# Altium project RelayDetect.PrjPcb
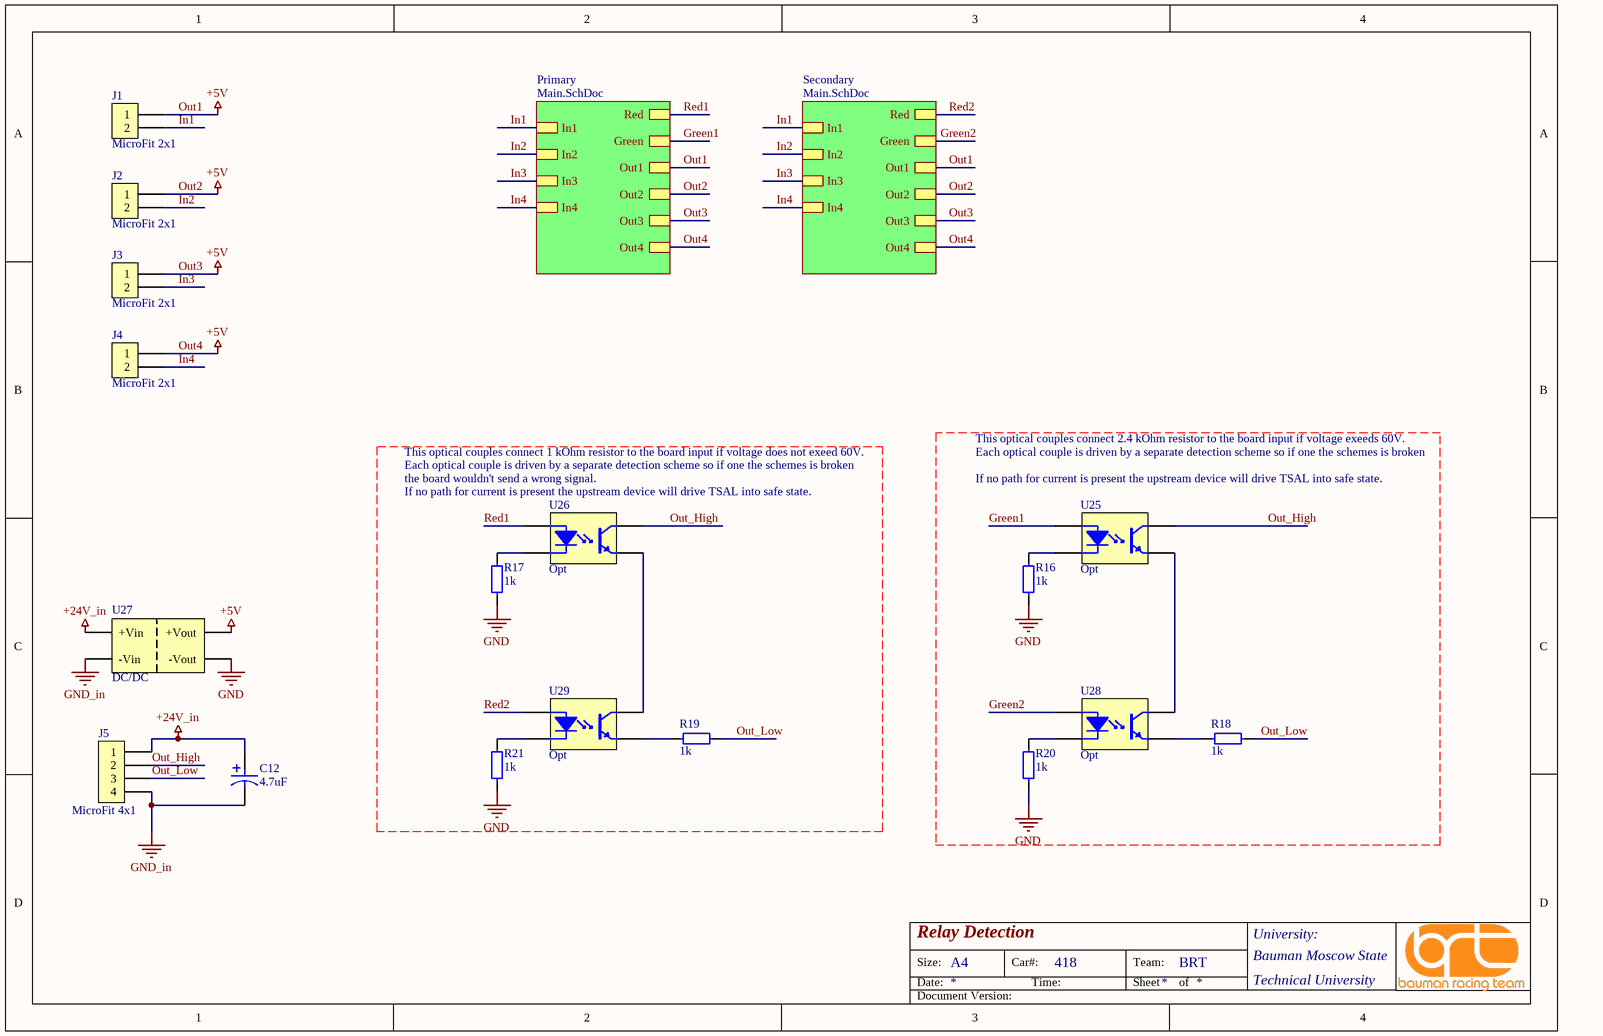
[diagram p0: 1.SchDoc]
3 sheets, 164 parts. Net scope: hierarchical (ports join the sheet entries above them; power ports are global).
Board file: RelayDetect.PcbDoc
Sheets:
  1.SchDoc
    Primary = Main.SchDoc
      Detection = DetectionPart.SchDoc
    Secondary = Main.SchDoc
      Detection = DetectionPart.SchDoc

## Sheet 1.SchDoc
size A4; Название устройства: Relay Detection

### Parts
(Parts that share a designator on the sheet are numbered #1, #2 ... from top to bottom, then left to right.)
*1  BRT Log  [BRT_Log]  (value not drawn)
C12#1  4.7uF  [Bar Cap 4x5.4]
J1  MicroFit 2x1  [MolexMicroFit 2x1]
J2  MicroFit 2x1  [MolexMicroFit 2x1]
J3  MicroFit 2x1  [MolexMicroFit 2x1]
J4  MicroFit 2x1  [MolexMicroFit 2x1]
J5  MicroFit 4x1  [MolexMicroFit 4x1]
R16#1  1k  [0603 Resistor]
R17#1  1k  [0603 Resistor]
R18#1  1k  [0603 Resistor]
R19#1  1k  [0603 Resistor]
R20#1  1k  [0603 Resistor]
R21#1  1k  [0603 Resistor]
U25#1  Opt  [FAIR-MDIP-4_V]
U26#1  Opt  [FAIR-MDIP-4_V]
U27#1  DC/DC  [SIP7]
U28#1  Opt  [FAIR-MDIP-4_V]
U29#1  Opt  [FAIR-MDIP-4_V]

### Sub-sheets
Primary = Main.SchDoc: Red, In1, Out3, In2, In3, Out1, Green, Out4, In4, Out2
Secondary = Main.SchDoc: Red, In1, Out3, In2, In3, Out1, Green, Out4, In4, Out2

### Nets
+24V_in: C12#1.2 J5.1 U27#1.1(+Vin)
GND: R16#1.1 R17#1.1 R20#1.1 R21#1.1 U27#1.4(-Vout)
GND_in: C12#1.1 J5.4 U27#1.2(-Vin)
Out1: J1.1 J2.1 J3.1 J4.1 U27#1.6(+Vout) ; sheet Primary/Out3, sheet Primary/Out1, sheet Primary/Out4, sheet Primary/Out2, sheet Secondary/Out3, sheet Secondary/Out1, sheet Secondary/Out4, sheet Secondary/Out2  [also labelled +5V, Out2, Out3, Out4]
Green1: U25#1.1(ANODE) ; sheet Primary/Green
Green2: U28#1.1(ANODE) ; sheet Secondary/Green
In1: J1.2 ; sheet Primary/In1, sheet Secondary/In1
In2: J2.2 ; sheet Primary/In2, sheet Secondary/In2
In3: J3.2 ; sheet Primary/In3, sheet Secondary/In3
In4: J4.2 ; sheet Primary/In4, sheet Secondary/In4
Out_High: J5.2 U25#1.4(COLLECTOR) U26#1.4(COLLECTOR)
Out_Low: J5.3 R18#1.1 R19#1.1
Red1: U26#1.1(ANODE) ; sheet Primary/Red
Red2: U29#1.1(ANODE) ; sheet Secondary/Red
NetR16#1_2: R16#1.2 U25#1.2(CATHODE)
NetR17#1_2: R17#1.2 U26#1.2(CATHODE)
NetR18#1_2: R18#1.2 U28#1.3(EMITTER)
NetR19#1_2: R19#1.2 U29#1.3(EMITTER)
NetR20#1_2: R20#1.2 U28#1.2(CATHODE)
NetR21#1_2: R21#1.2 U29#1.2(CATHODE)
NetU25#1_3: U25#1.3(EMITTER) U28#1.4(COLLECTOR)
NetU26#1_3: U26#1.3(EMITTER) U29#1.4(COLLECTOR)

### Notes on the sheet
- This optical couples connect 2.4 kOhm resistor to the board input if voltage exeeds 60V.
- This optical couples connect 1 kOhm resistor to the board input if voltage does not exeed 60V.
- (near U26#1) Each optical couple is driven by a separate detection scheme so if one the schemes is broken
- (near U26#1) the board wouldn't send a wrong signal.
- (near U26#1) If no path for current is present the upstream device will drive TSAL into safe state.
- Each optical couple is driven by a separate detection scheme so if one the schemes is broken
- (near U25#1) If no path for current is present the upstream device will drive TSAL into safe state.
- Size:
- Date:
- A4
- Car#:
- Time:
- 418
- Team:
- Sheet
- BRT
- of
- University:
- Technical University
- Bauman Moscow State
- Document Version:

### Library data of the parts
*1 = BRT Log: Team Logo
C12#1 = Cap Pol 4.7uF: ECAP SMD,  35V, 105°C; Part Number: B41121A7475M000; Manufacturer: Epcos; Type: Capacitor; ComponentLink1Description: Chip&Dip; ComponentLink1URL: https://www.chipdip.ru/product/b41121a7475m000
J1-J4 = Conn 2 [MicroFit]: Micro-Fit 3.0 Right-Angle Header, 3.00mm Pitch, Single Row, 2 Circuits, with Snap-in Plastic Peg PCB Lock, Tin, Glow-Wire Capable, Black; Part Number: 436500200; Manufacturer: Molex; ComponentLink1Description: Molex; ComponentLink1URL: https://www.molex.com/molex/products/part-detail/pcb_headers/0436500200; Type: Connector
J5 = Conn 4 [MicroFit]: Micro-Fit 3.0 Right-Angle Header, 3.00mm Pitch, Single Row, 4 Circuits, with Snap-in Plastic Peg PCB Lock, Tin, Glow-Wire Capable, Black; Part Number: 436500400; Manufacturer: Molex; ComponentLink1Description: Molex; ComponentLink1URL: https://www.molex.com/molex/products/part-detail/pcb_headers/0436500400; Type: Connector
R16#1 R17#1 R18#1 R19#1 R20#1 R21#1 = Res 1k (0603): 0.1W 0603 1k, 1%; Part Number: RC0603FR-071KL; Manufacturer: Taiwan; Type: Resistor; ComponentLink1Description: Chip&Dip; ComponentLink1URL: https://www.chipdip.ru/product0/9000079676
U25#1 U26#1 U28#1 U29#1 = Optocoupler [FOD817B]: Phototransistor Optocoupler, 4 us Rise, 3 us Fall, 5000 Vrms, -55 to 110 degC, 4-Pin MDIP, RoHS, Tape and Reel; Manufacturer: ON Semiconductor; Part Nomber: FOD817B; ComponentLink1Description: Chip&Dip; ComponentLink1URL: https://www.chipdip.ru/product/fod817b; ComponentLink2Description: DataSheet; ComponentLink2URL: https://static.chipdip.ru/lib/297/DOC000297284.pdf
U27#1 = DC/DC Isolated 12V [TMH]: The TMH series are ultra miniature, isolated 2 Watt DC/DC-converters in a Single-in-Line  package  (SIP); Manufacturer: Traco Power; Part Number: TMH2412S; Input Voltage: 24; Output Voltage: 12; ComponentLink1Description: Chip&Dip; ComponentLink1URL: https://www.chipdip.ru/product/tmv2412s; ComponentLink2Description: DataSheet; ComponentLink2URL: https://static.chipdip.ru/lib/005/DOC001005854.pdf; Type: IC

## Sheet Main.SchDoc
size A3; Date: 04.01.2021; Organization: Altium Limited; Address1: L3, 12a Rodborough Rd; Address2: Frenchs Forest; Address3: NSW; Address4: Australia 2086; SheetNumber: 1; SheetTotal: 3; Version: 1; Название устройства: Main
Used 2 times, as channels Primary, Secondary. Parts and nets are listed once, with the designators drawn on the sheet.
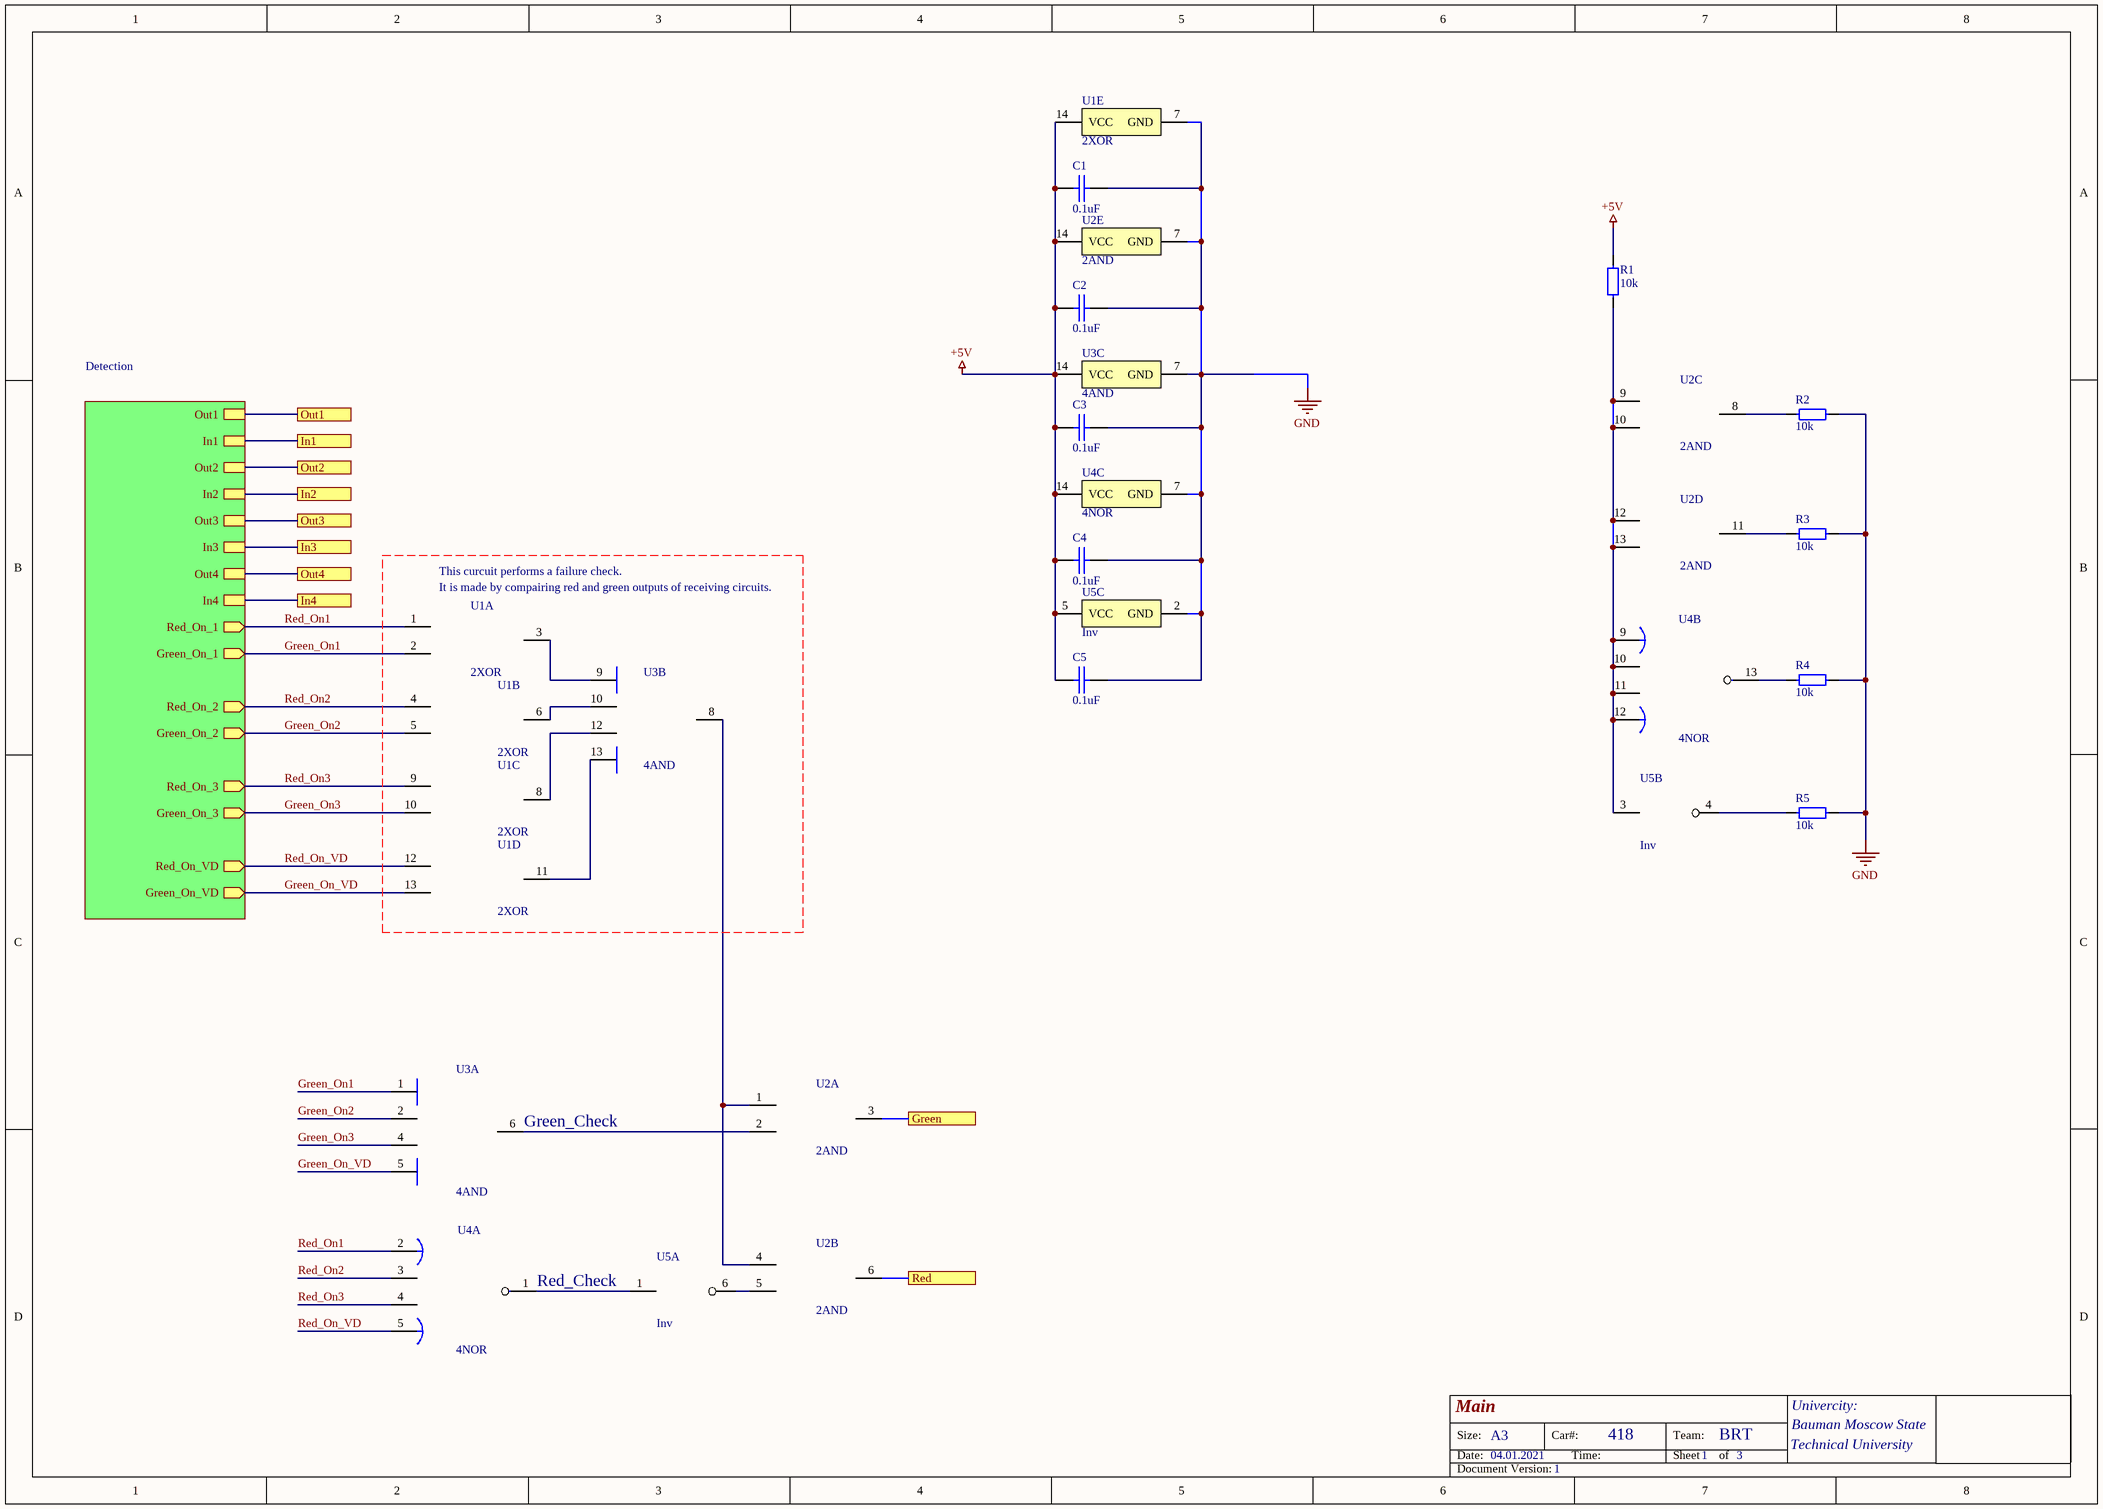
[diagram p1: Main.SchDoc]

### Parts
C1  0.1uF  [0603 Capicator]
C2  0.1uF  [0603 Capicator]
C3  0.1uF  [0603 Capicator]
C4  0.1uF  [0603 Capicator]
C5  0.1uF  [0603 Capicator]
R1  10k  [0603 Resistor]
R2  10k  [0603 Resistor]
R3  10k  [0603 Resistor]
R4  10k  [0603 Resistor]
R5  10k  [0603 Resistor]
U1  2XOR  [SOIC-14]  (parts A,B,C,D,E of 5)
U2  2AND  [SOIC-14]  (parts A,B,C,D,E of 5)
U3  4AND  [SOIC-14]  (parts A,B,C of 3)
U4  4NOR  [SOIC-14]  (parts A,B,C of 3)
U5  Inv  [SOT236]  (parts A,B,C of 3)

### Sub-sheets
Detection = DetectionPart.SchDoc: Green_On_2 (out), Red_On_1 (out), Red_On_VD (out), Green_On_VD (out), Red_On_2 (out), Green_On_3 (out), Red_On_3 (out), Green_On_1 (out), Out4, Out3, Out1, In3, In2, Out2, In1, In4

### Ports
Green, In1, In2, In3, In4, Out1, Out2, Out3, Out4, Red

### Nets
+5V: C1.2 C2.2 C3.2 C4.2 C5.2 R1.2 U1.14(VCC) U2.14(VCC) U3.14(VCC) U4.14(VCC) U5.5(VCC)
GND: C1.1 C2.1 C3.1 C4.1 C5.1 R2.1 R3.1 R4.1 R5.1 U1.7(GND) U2.7(GND) U3.7(GND) U4.7(GND) U5.2(GND)
Green: U2.3(1Y) ; port Green
Green_On1: U1.2(B) U3.1(A) ; sheet Detection/Green_On_1
Green_On2: U1.5(B) U3.2(B) ; sheet Detection/Green_On_2
Green_On3: U1.10(B) U3.4(C) ; sheet Detection/Green_On_3
Green_On_VD: U1.13(B) U3.5(D) ; sheet Detection/Green_On_VD
In1: port In1, sheet Detection/In1
In2: port In2, sheet Detection/In2
In3: port In3, sheet Detection/In3
In4: port In4, sheet Detection/In4
Out1: port Out1, sheet Detection/Out1
Out2: port Out2, sheet Detection/Out2
Out3: port Out3, sheet Detection/Out3
Out4: port Out4, sheet Detection/Out4
Red: U2.6(2Y) ; port Red
Red_On1: U1.1(A) U4.2(A) ; sheet Detection/Red_On_1
Red_On2: U1.4(A) U4.3(B) ; sheet Detection/Red_On_2
Red_On3: U1.9(A) U4.4(C) ; sheet Detection/Red_On_3
Red_On_VD: U1.12(A) U4.5(D) ; sheet Detection/Red_On_VD
NetR1_1: R1.1 U2.9(3A) U2.10(3B) U2.12(4A) U2.13(4B) U4.9(A) U4.10(B) U4.11(C) U4.12(D) U5.3(2А)
NetR2_2: R2.2 U2.8(3Y)
NetR3_2: R3.2 U2.11(4Y)
NetR4_2: R4.2 U4.13(Y)
NetR5_2: R5.2 U5.4(2Y)
NetU1_3: U1.3(Y) U3.9(A)
NetU1_6: U1.6(Y) U3.10(B)
NetU1_8: U1.8(Y) U3.12(C)
NetU1_11: U1.11(Y) U3.13(D)
NetU2_1: U2.1(1A) U2.4(2A) U3.8(Y)
NetU2_2: U2.2(1B) U3.6(Y)
NetU2_5: U2.5(2B) U5.6(1Y)
NetU4_1: U4.1(Y) U5.1(1A)

### Channels
Primary: designators C1=C38 C2=C39 C3=C40 C4=C41 C5=C42 R1=R27 R2=R28 R3=R29 R4=R30 R5=R31 U1=U42 U2=U43 U3=U44 U4=U45 U5=U46; ports Green=Green1 In1=In1 In2=In2 In3=In3 In4=In4 Out1=Out1 Out2=Out1 Out3=Out1 Out4=Out1 Red=Red1
Secondary: designators C1=C43 C2=C44 C3=C45 C4=C46 C5=C47 R1=R32 R2=R33 R3=R34 R4=R35 R5=R36 U1=U47 U2=U48 U3=U49 U4=U50 U5=U51; ports Green=Green2 In1=In1 In2=In2 In3=In3 In4=In4 Out1=Out1 Out2=Out1 Out3=Out1 Out4=Out1 Red=Red2

### Notes on the sheet
- (near U1) This curcuit performs a failure check.
- (near U1) It is made by compairing red and green outputs of receiving circuits.
- (near U3) Green_Check
- Red_Check
- Size:
- Date:
- A3
- Car#:
- Time:
- 418
- Team:
- Sheet
- BRT
- of
- Technical University
- Univercity:
- Bauman Moscow State
- Document Version:

### Library data of the parts
C1-C5 = Cap 0.1uF (0603): 0.1uF X7R 16V 10% 0603; Manufacturer: Murata Manufacturing; Part Number: GRM188R71C104KA01D; Type: Capacitor; ComponentLink1Description: Chip&Dip; ComponentLink1URL: https://www.chipdip.ru/product/grm188r71c104ka01d
R1-R5 = Res 10k (0603): 0.1W 0603 10k, 1%; Part Number: RC0603FR-0710KL; Manufacturer: Taiwan; Type: Resistor; ComponentLink1Description: Chip&Dip; ComponentLink1URL: https://www.chipdip.ru/product0/9000079736
U1 = 4(2XOR): 4 logic elements "2XOR"; Part Number: 74HC86D,653; Manufacturer: Nexperia; ComponentLink1Description: Chip&Dip; ComponentLink1URL: https://www.chipdip.ru/product/74hc86d; Type: IC; ComponentLink2Description: DataSheet; ComponentLink2URL: https://ru.mouser.com/datasheet/2/916/74HC_HCT86-1319799.pdf
U2 = 2And: 4 logic elements "2AND"; Part Number: SN74AC08DR; Manufacturer: Texas Instruments; ComponentLink1Description: DataSheet; ComponentLink1URL: https://static.chipdip.ru/lib/551/DOC001551527.pdf; ComponentLink2Description: Chip&Dip; ComponentLink2URL: https://www.chipdip.ru/product/sn74ac08dr; Type: IC
U3 = 2(4AND): 2 logic elements "4AND"; Part Number: 74HC21D,653; Manufacturer: Nexperia; ComponentLink1Description: Chip&Dip; ComponentLink1URL: https://www.chipdip.ru/product/74hc21d.653; Type: IC; ComponentLink2Description: DataSheet; ComponentLink2URL: https://static.chipdip.ru/lib/522/DOC011522559.pdf
U4 = 2(4NOR): 2 logic elements "4NOR"; Part Number: 74HC4002D,652; Manufacturer: Nexperia; ComponentLink1Description: Chip&Dip; ComponentLink1URL: https://www.chipdip.ru/product/74hc4002d; Type: IC; ComponentLink2Description: DataSheet; ComponentLink2URL: https://static.chipdip.ru/lib/493/DOC011493188.pdf
U5 = Inverter (SN74): Dual inverter, 1.65-5.5V; Manufacturer: Texas Instruments; Part Number: SN74LVC2G04DBVR; ComponentLink1Description: Chip&Dip; ComponentLink1URL: https://www.chipdip.ru/product/sn74lvc2g04dbvr-2; ComponentLink2Description: DataSheet; ComponentLink2URL: https://static.chipdip.ru/lib/021/DOC001021810.pdf; Type: IC

## Sheet DetectionPart.SchDoc
size A3; ENG_APP_DATE: --/--/--; DSN_APP_DATE: --/--/--; CHK_APP_DATE: --/--/--; Date: 04.01.2021; Organization: Altium Limited; Address1: L3, 12a Rodborough Rd; Address2: Frenchs Forest; Address3: NSW; Address4: Australia 2086; SheetNumber: 2; SheetTotal: 3; Название устройства: Detection Part; Version: 1
Used 2 times, as channels Primary/Detection, Secondary/Detection. Parts and nets are listed once, with the designators drawn on the sheet.
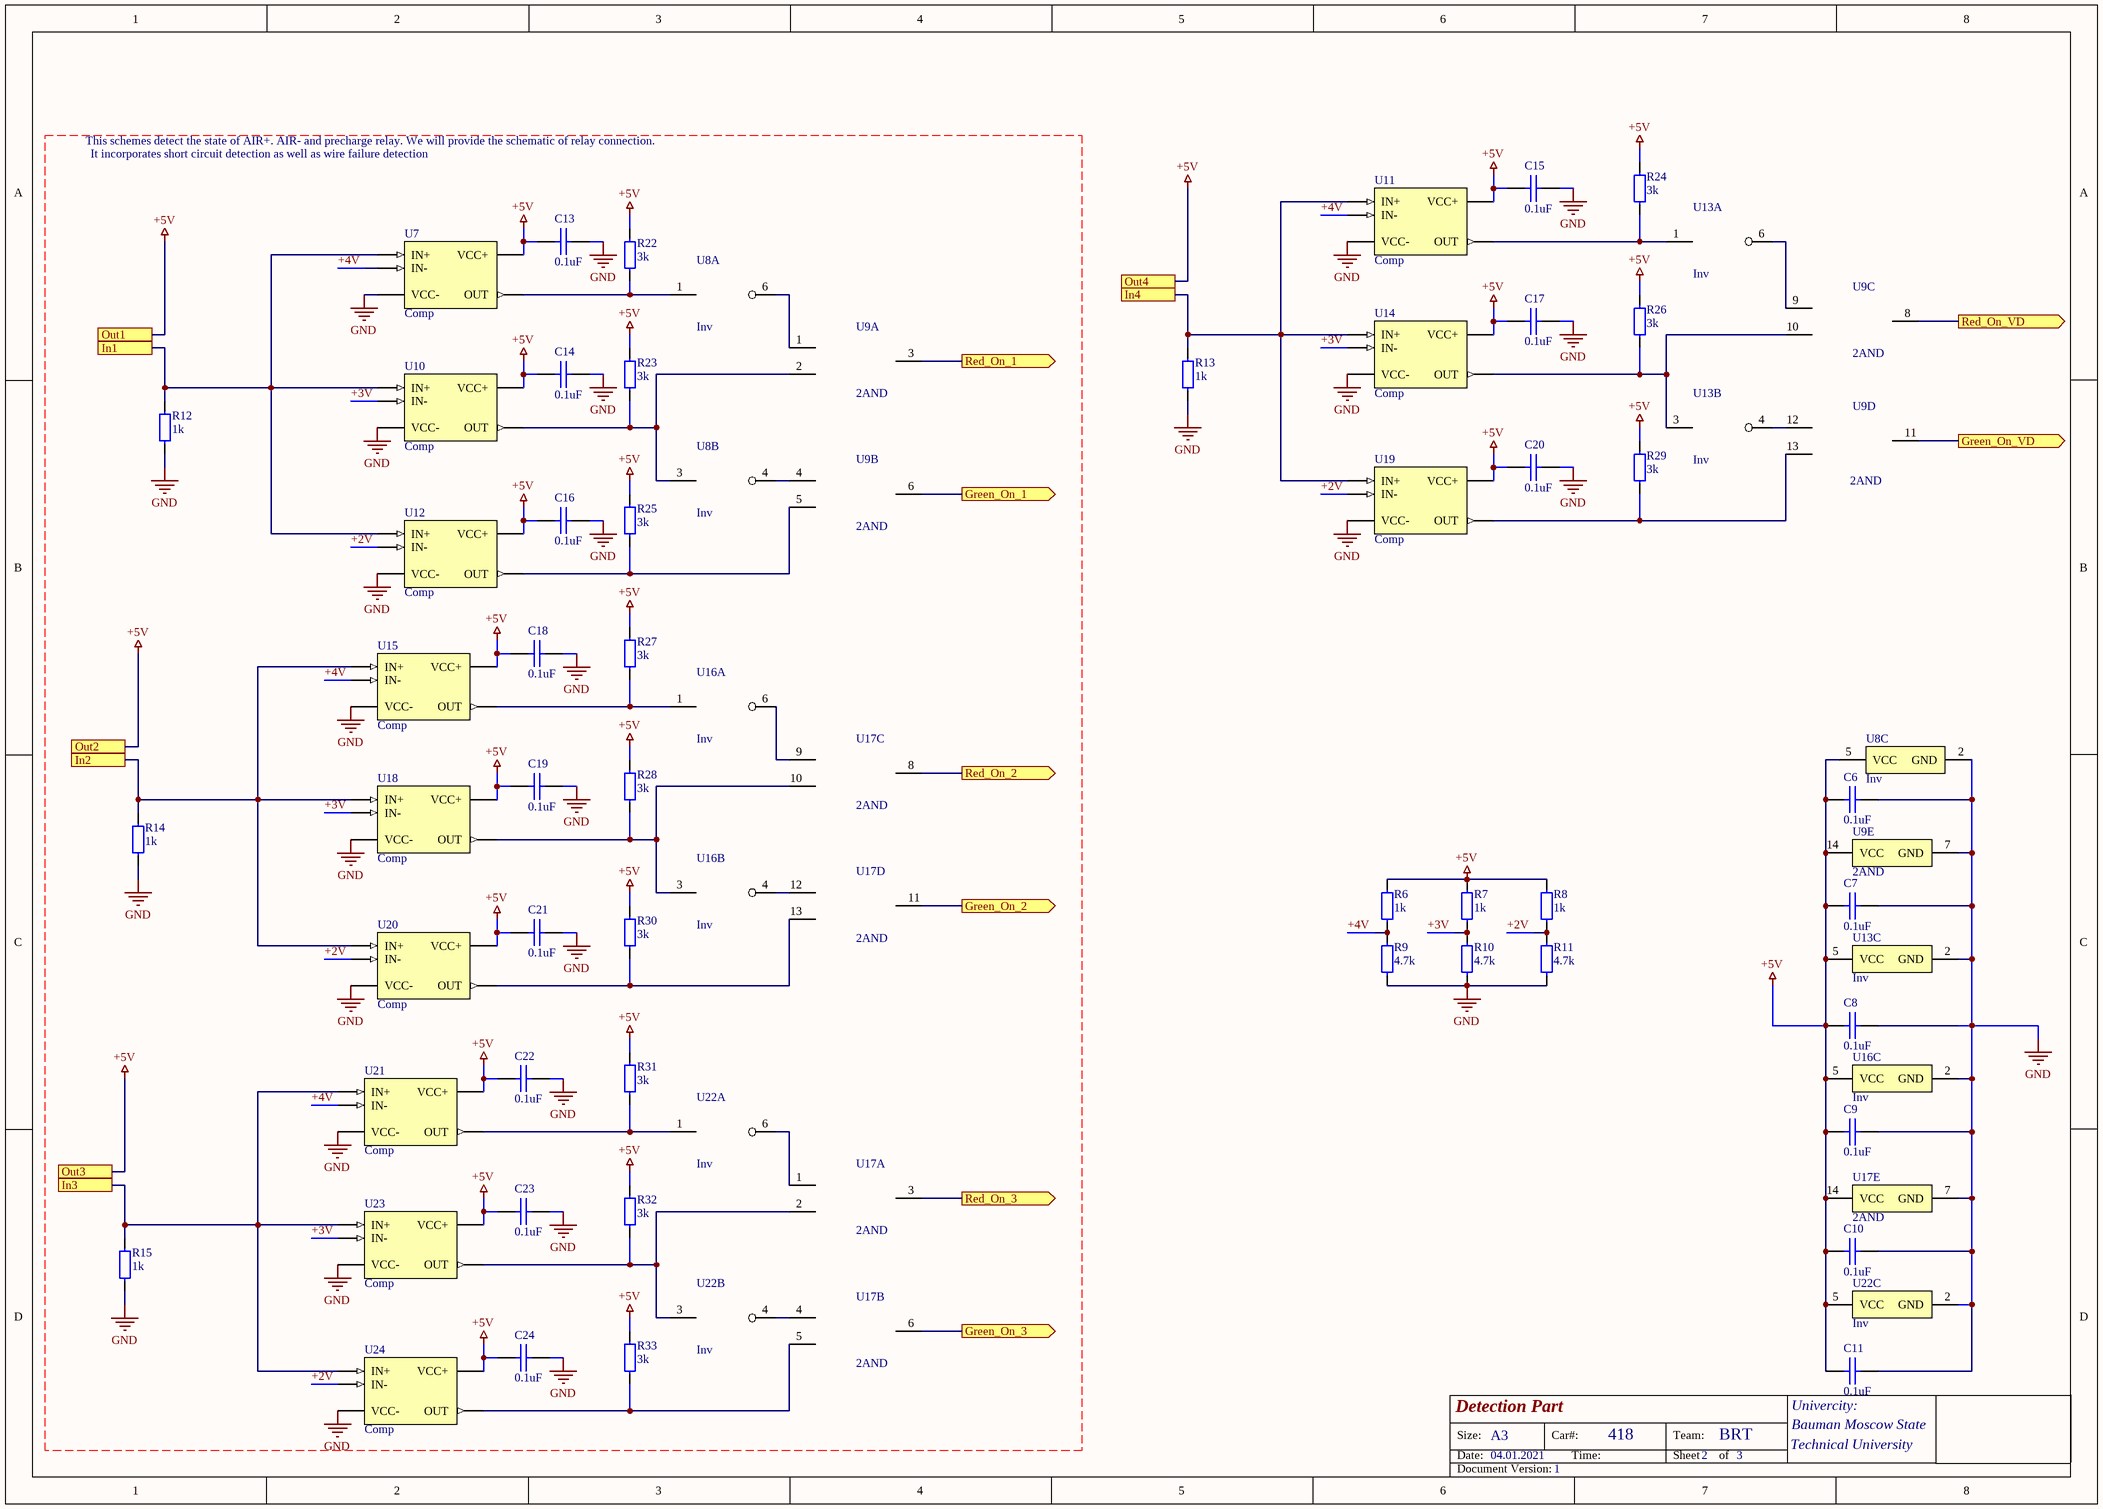
[diagram p2: DetectionPart.SchDoc]

### Parts
C6  0.1uF  [0603 Capicator]
C7  0.1uF  [0603 Capicator]
C8  0.1uF  [0603 Capicator]
C9  0.1uF  [0603 Capicator]
C10  0.1uF  [0603 Capicator]
C11  0.1uF  [0603 Capicator]
C13  0.1uF  [0603 Capicator]
C14  0.1uF  [0603 Capicator]
C15  0.1uF  [0603 Capicator]
C16  0.1uF  [0603 Capicator]
C17  0.1uF  [0603 Capicator]
C18  0.1uF  [0603 Capicator]
C19  0.1uF  [0603 Capicator]
C20  0.1uF  [0603 Capicator]
C21  0.1uF  [0603 Capicator]
C22  0.1uF  [0603 Capicator]
C23  0.1uF  [0603 Capicator]
C24  0.1uF  [0603 Capicator]
R6  1k  [0603 Resistor]
R7  1k  [0603 Resistor]
R8  1k  [0603 Resistor]
R9  4.7k  [0603 Resistor]
R10  4.7k  [0603 Resistor]
R11  4.7k  [0603 Resistor]
R12  1k  [0603 Resistor]
R13  1k  [0603 Resistor]
R14  1k  [0603 Resistor]
R15  1k  [0603 Resistor]
R22  3k  [0603 Resistor]
R23  3k  [0603 Resistor]
R24  3k  [0603 Resistor]
R25  3k  [0603 Resistor]
R26  3k  [0603 Resistor]
R27  3k  [0603 Resistor]
R28  3k  [0603 Resistor]
R29  3k  [0603 Resistor]
R30  3k  [0603 Resistor]
R31  3k  [0603 Resistor]
R32  3k  [0603 Resistor]
R33  3k  [0603 Resistor]
U7  Comp  [SOT-23-5]
U8  Inv  [SOT236]  (parts A,B,C of 3)
U9  2AND  [SOIC-14]  (parts A,B,C,D,E of 5)
U10  Comp  [SOT-23-5]
U11  Comp  [SOT-23-5]
U12  Comp  [SOT-23-5]
U13  Inv  [SOT236]  (parts A,B,C of 3)
U14  Comp  [SOT-23-5]
U15  Comp  [SOT-23-5]
U16  Inv  [SOT236]  (parts A,B,C of 3)
U17  2AND  [SOIC-14]  (parts A,B,C,D,E of 5)
U18  Comp  [SOT-23-5]
U19  Comp  [SOT-23-5]
U20  Comp  [SOT-23-5]
U21  Comp  [SOT-23-5]
U22  Inv  [SOT236]  (parts A,B,C of 3)
U23  Comp  [SOT-23-5]
U24  Comp  [SOT-23-5]

### Ports
Green_On_1 (out), Green_On_2 (out), Green_On_3 (out), Green_On_VD (out), In1, In2, In3, In4, Out1, Out2, Out3, Out4, Red_On_1 (out), Red_On_2 (out), Red_On_3 (out), Red_On_VD (out)

### Nets
+5V: C6.1 C7.2 C8.2 C9.2 C10.2 C11.2 C13.2 C14.2 C15.2 C16.2 C17.2 C18.2 C19.2 C20.2 C21.2 C22.2 C23.2 C24.2 R6.2 R7.2 R8.2 R22.2 R23.2 R24.2 R25.2 R26.2 R27.2 R28.2 R29.2 R30.2 R31.2 R32.2 R33.2 U7.5(VCC+) U8.5(VCC) U9.14(VCC) U10.5(VCC+) U11.5(VCC+) U12.5(VCC+) U13.5(VCC) U14.5(VCC+) U15.5(VCC+) U16.5(VCC) U17.14(VCC) U18.5(VCC+) U19.5(VCC+) U20.5(VCC+) U21.5(VCC+) U22.5(VCC) U23.5(VCC+) U24.5(VCC+) ; port Out1, port Out2, port Out3, port Out4
GND: C6.2 C7.1 C8.1 C9.1 C10.1 C11.1 C13.1 C14.1 C15.1 C16.1 C17.1 C18.1 C19.1 C20.1 C21.1 C22.1 C23.1 C24.1 R9.1 R10.1 R11.1 R12.1 R13.1 R14.1 R15.1 U7.2(VCC-) U8.2(GND) U9.7(GND) U10.2(VCC-) U11.2(VCC-) U12.2(VCC-) U13.2(GND) U14.2(VCC-) U15.2(VCC-) U16.2(GND) U17.7(GND) U18.2(VCC-) U19.2(VCC-) U20.2(VCC-) U21.2(VCC-) U22.2(GND) U23.2(VCC-) U24.2(VCC-)
+2V: R8.1 R11.2 U12.3(IN-) U19.3(IN-) U20.3(IN-) U24.3(IN-)
+3V: R7.1 R10.2 U10.3(IN-) U14.3(IN-) U18.3(IN-) U23.3(IN-)
+4V: R6.1 R9.2 U7.3(IN-) U11.3(IN-) U15.3(IN-) U21.3(IN-)
Green_On_1: U9.6(2Y) ; port Green_On_1
Green_On_2: U17.11(4Y) ; port Green_On_2
Green_On_3: U17.6(2Y) ; port Green_On_3
Green_On_VD: U9.11(4Y) ; port Green_On_VD
In1: R12.2 U7.1(IN+) U10.1(IN+) U12.1(IN+) ; port In1
In2: R14.2 U15.1(IN+) U18.1(IN+) U20.1(IN+) ; port In2
In3: R15.2 U21.1(IN+) U23.1(IN+) U24.1(IN+) ; port In3
In4: R13.2 U11.1(IN+) U14.1(IN+) U19.1(IN+) ; port In4
Red_On_1: U9.3(1Y) ; port Red_On_1
Red_On_2: U17.8(3Y) ; port Red_On_2
Red_On_3: U17.3(1Y) ; port Red_On_3
Red_On_VD: U9.8(3Y) ; port Red_On_VD
NetR22_1: R22.1 U7.4(OUT) U8.1(1A)
NetR23_1: R23.1 U8.3(2А) U9.2(1B) U10.4(OUT)
NetR24_1: R24.1 U11.4(OUT) U13.1(1A)
NetR25_1: R25.1 U9.5(2B) U12.4(OUT)
NetR26_1: R26.1 U9.10(3B) U13.3(2А) U14.4(OUT)
NetR27_1: R27.1 U15.4(OUT) U16.1(1A)
NetR28_1: R28.1 U16.3(2А) U17.10(3B) U18.4(OUT)
NetR29_1: R29.1 U9.13(4B) U19.4(OUT)
NetR30_1: R30.1 U17.13(4B) U20.4(OUT)
NetR31_1: R31.1 U21.4(OUT) U22.1(1A)
NetR32_1: R32.1 U17.2(1B) U22.3(2А) U23.4(OUT)
NetR33_1: R33.1 U17.5(2B) U24.4(OUT)
NetU8_4: U8.4(2Y) U9.4(2A)
NetU8_6: U8.6(1Y) U9.1(1A)
NetU9_9: U9.9(3A) U13.6(1Y)
NetU9_12: U9.12(4A) U13.4(2Y)
NetU16_4: U16.4(2Y) U17.12(4A)
NetU16_6: U16.6(1Y) U17.9(3A)
NetU17_1: U17.1(1A) U22.6(1Y)
NetU17_4: U17.4(2A) U22.4(2Y)

### Channels
Primary/Detection: designators C6=C11 C7=C13 C8=C15 C9=C16 C10=C18 C11=C19 C13=C2 C14=C3 C15=C4 C16=C5 C17=C6 C18=C7 C19=C8 C20=C9 C21=C10 C22=C12#2 C23=C14 C24=C17 R6=R7 R7=R8 R8=R9 R9=R10 R10=R11 R11=R12 R12=R13 R13=R14 R14=R15 R15=R16#2 R22=R37 R23=R38 R24=R39 R25=R40 R26=R41 R27=R42 R28=R43 R29=R44 R30=R45 R31=R46 R32=R47 R33=R48 U7=U6 U8=U16 U9=U13 U10=U7 U11=U8 U12=U9 U13=U12 U14=U10 U15=U11 U16=U20 U17=U22 U18=U14 U19=U15 U20=U17 U21=U18 U22=U23 U23=U19 U24=U21; ports Green_On_1=Green_On1_Primary Green_On_2=Green_On2_Primary Green_On_3=Green_On3_Primary Green_On_VD=Green_On_VD_Primary In1=In1 In2=In2 In3=In3 In4=In4 Out1=Out1 Out2=Out1 Out3=Out1 Out4=Out1 Red_On_1=Red_On1_Primary Red_On_2=Red_On2_Primary Red_On_3=Red_On3_Primary Red_On_VD=Red_On_VD_Primary
Secondary/Detection: designators C6=C29 C7=C31 C8=C33 C9=C34 C10=C36 C11=C37 C13=C20 C14=C21 C15=C22 C16=C23 C17=C24 C18=C25 C19=C26 C20=C27 C21=C28 C22=C30 C23=C32 C24=C35 R6=R17#2 R7=R18#2 R8=R19#2 R9=R20#2 R10=R21#2 R11=R22 R12=R23 R13=R24 R14=R25 R15=R26 R22=R49 R23=R50 R24=R51 R25=R52 R26=R53 R27=R54 R28=R55 R29=R56 R30=R57 R31=R58 R32=R59 R33=R60 U7=U24 U8=U34 U9=U31 U10=U25#2 U11=U26#2 U12=U27#2 U13=U30 U14=U28#2 U15=U29#2 U16=U38 U17=U40 U18=U32 U19=U33 U20=U35 U21=U36 U22=U41 U23=U37 U24=U39; ports Green_On_1=Green_On1_Secondary Green_On_2=Green_On2_Secondary Green_On_3=Green_On3_Secondary Green_On_VD=Green_On_VD_Secondary In1=In1 In2=In2 In3=In3 In4=In4 Out1=Out1 Out2=Out1 Out3=Out1 Out4=Out1 Red_On_1=Red_On1_Secondary Red_On_2=Red_On2_Secondary Red_On_3=Red_On3_Secondary Red_On_VD=Red_On_VD_Secondary

### Notes on the sheet
- This schemes detect the state of AIR+. AIR- and precharge relay. We will provide the schematic of relay connection.
- It incorporates short circuit detection as well as wire failure detection
- Size:
- Date:
- A3
- Car#:
- Time:
- 418
- Team:
- Sheet
- BRT
- of
- Technical University
- Univercity:
- Bauman Moscow State
- Document Version:

### Library data of the parts
C6-C11 C13-C24 = Cap 0.1uF (0603): as C1 on sheet Main; ComponentLink1Description: Chip&Dip; ComponentLink1URL: https://www.chipdip.ru/product/grm188r71c104ka01d
R6-R8 R12-R15 = Res 1k (0603): as R16#1 on sheet 1; Type: Resistor; ComponentLink1Description: Chip&Dip; ComponentLink1URL: https://www.chipdip.ru/product0/9000079676
R9-R11 = Res 4.7k (0603): 0.1W 0603 4.7k, 1%; Part Number: RC0603FR-074K7L; Manufacturer: Taiwan; Type: Resistor; ComponentLink1Description: Chip&Dip; ComponentLink1URL: https://www.chipdip.ru/product0/9000079728
R22-R33 = Res 3k (0603): 0.1W 0603 3k, 1%; Part Number: RC0603FR-073KL; Manufacturer: Taiwan; Type: Resistor; ComponentLink1Description: Chip&Dip; ComponentLink1URL: https://www.chipdip.ru/product0/9000079723
U7 U10-U12 U14 U15 U18-U21 U23 U24 = Comparator [LMV]: Differential comparator with strobes; Part Number: LMV331M5/NOPB; Manufacturer: Texas Instruments; ComponentLink1Description: DataSheet; ComponentLink1URL: https://static.chipdip.ru/lib/291/DOC000291302.pdf; ComponentLink2Description: Chip&Dip; ComponentLink2URL: https://www.chipdip.ru/product/lmv331m5-nopb; Type: IC
U8 U13 U16 U22 = Inverter (SN74): as U5 on sheet Main; ComponentLink1Description: Chip&Dip; ComponentLink1URL: https://www.chipdip.ru/product/sn74lvc2g04dbvr-2; ComponentLink2Description: DataSheet; ComponentLink2URL: https://static.chipdip.ru/lib/021/DOC001021810.pdf; Type: IC
U9 U17 = 2And: as U2 on sheet Main; ComponentLink1Description: DataSheet; ComponentLink1URL: https://static.chipdip.ru/lib/551/DOC001551527.pdf; ComponentLink2Description: Chip&Dip; ComponentLink2URL: https://www.chipdip.ru/product/sn74ac08dr; Type: IC

## Nets that join several sheets
GND: 1 (5 pins), Primary (14 pins), Primary/Detection (43 pins), Secondary (14 pins), Secondary/Detection (43 pins)
Out1: 1 (5 pins), Primary (11 pins), Primary/Detection (51 pins), Secondary (11 pins), Secondary/Detection (51 pins)
Green1: 1 (U25#1.1), Primary (U43.3)
Green2: 1 (U28#1.1), Secondary (U48.3)
Green_On1_Primary: Primary (U42.2 U44.1), Primary/Detection (U13.6)
Green_On1_Secondary: Secondary (U47.2 U49.1), Secondary/Detection (U31.6)
Green_On2_Primary: Primary (U42.5 U44.2), Primary/Detection (U22.11)
Green_On2_Secondary: Secondary (U47.5 U49.2), Secondary/Detection (U40.11)
Green_On3_Primary: Primary (U42.10 U44.4), Primary/Detection (U22.6)
Green_On3_Secondary: Secondary (U47.10 U49.4), Secondary/Detection (U40.6)
Green_On_VD_Primary: Primary (U42.13 U44.5), Primary/Detection (U13.11)
Green_On_VD_Secondary: Secondary (U47.13 U49.5), Secondary/Detection (U31.11)
In1: 1 (J1.2), Primary/Detection (R13.2 U6.1 U7.1 U9.1), Secondary/Detection (R23.2 U24.1 U25#2.1 U27#2.1)
In2: 1 (J2.2), Primary/Detection (R15.2 U11.1 U14.1 U17.1), Secondary/Detection (R25.2 U29#2.1 U32.1 U35.1)
In3: 1 (J3.2), Primary/Detection (R16#2.2 U18.1 U19.1 U21.1), Secondary/Detection (R26.2 U36.1 U37.1 U39.1)
In4: 1 (J4.2), Primary/Detection (R14.2 U8.1 U10.1 U15.1), Secondary/Detection (R24.2 U26#2.1 U28#2.1 U33.1)
Red1: 1 (U26#1.1), Primary (U43.6)
Red2: 1 (U29#1.1), Secondary (U48.6)
Red_On1_Primary: Primary (U42.1 U45.2), Primary/Detection (U13.3)
Red_On1_Secondary: Secondary (U47.1 U50.2), Secondary/Detection (U31.3)
Red_On2_Primary: Primary (U42.4 U45.3), Primary/Detection (U22.8)
Red_On2_Secondary: Secondary (U47.4 U50.3), Secondary/Detection (U40.8)
Red_On3_Primary: Primary (U42.9 U45.4), Primary/Detection (U22.3)
Red_On3_Secondary: Secondary (U47.9 U50.4), Secondary/Detection (U40.3)
Red_On_VD_Primary: Primary (U42.12 U45.5), Primary/Detection (U13.8)
Red_On_VD_Secondary: Secondary (U47.12 U50.5), Secondary/Detection (U31.8)